# Altium schematic sheet power.SchDoc
size A4; SheetNumber: 3; SheetTotal: 6
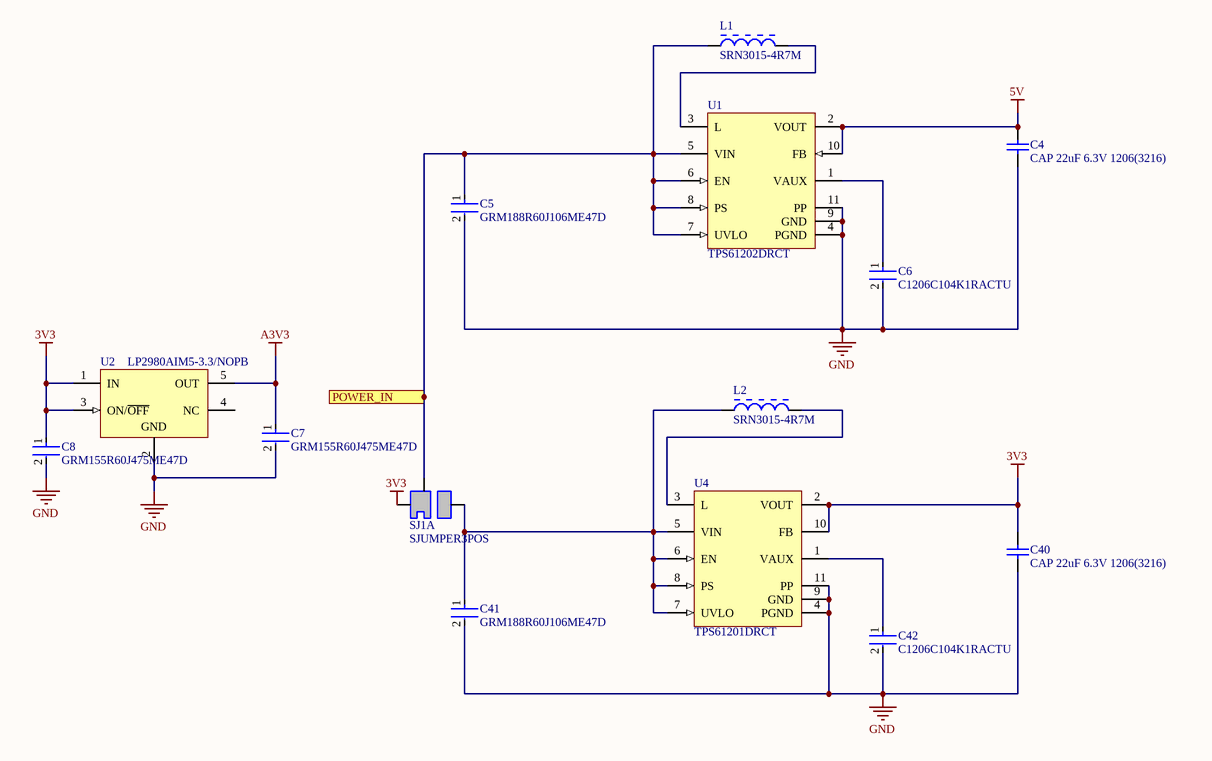
[diagram p0: power.SchDoc]

## Parts
C4  CAP 22uF 6.3V 1206(3216)  [CAPC1206(3216)190_M]
C5  GRM188R60J106ME47D  [FP-GRM188-0_1-e0_2_0_55-MFG]
C6  C1206C104K1RACTU  [FP-C1206C-EB-MFG]
C7  GRM155R60J475ME47D  [FP-GRM155-0_1-IPC_B]
C8  GRM155R60J475ME47D  [FP-GRM155-0_1-IPC_B]
C40  CAP 22uF 6.3V 1206(3216)  [CAPC1206(3216)190_M]
C41  GRM188R60J106ME47D  [FP-GRM188-0_1-e0_2_0_55-MFG]
C42  C1206C104K1RACTU  [FP-C1206C-EB-MFG]
L1  SRN3015-4R7M  [BOUR-SRN3015-2_V]
L2  SRN3015-4R7M  [BOUR-SRN3015-2_V]
SJ1  SJUMPER3POS  [SJUMPER3POS-Footprint-1]  (part A of 2)
U1  TPS61202DRCT  [DRC0010J_V]
U2  LP2980AIM5-3.3/NOPB  [MF05A_L]
U4  TPS61201DRCT  [DRC0010J_V]

## Ports
POWER_IN

## Nets
3V3: C8.1 C40.2 SJ1.1 U2.1(IN) U2.3(ON/~{OFF}) U4.2(VOUT) U4.10(FB)
5V: C4.2 U1.2(VOUT) U1.10(FB)
A3V3: C7.1 U2.5(OUT)
GND: C4.1 C5.2 C6.2 C7.2 C8.2 C40.1 C41.2 C42.2 U1.4(PGND) U1.9(GND) U1.11(PP) U2.2(GND) U4.4(PGND) U4.9(GND) U4.11(PP)
POWER_IN: C5.1 L1.1 SJ1.2 U1.5(VIN) U1.6(EN) U1.7(UVLO) U1.8(PS) ; port POWER_IN
NetC6_1: C6.1 U1.1(VAUX)
NetC41_1: C41.1 L2.1 SJ1.3 U4.5(VIN) U4.6(EN) U4.7(UVLO) U4.8(PS)
NetC42_1: C42.1 U4.1(VAUX)
NetL1_2: L1.2 U1.3(L)
NetL2_2: L2.2 U4.3(L)

Not connected (* = marked no-connect by the designer): U2 4(NC)

## Library data of the parts
C4 C40 = CMP-1037-04986-1: CAP 22uF 6.3V ±20% 1206 (3216 Metric) Thickness 1.9mm SMD; Case-EIA: 1206; Tolerance: Â±20%; Case-Metric: 3216; Value: 22uF; Max Thickness: 1.9 mm; Rated Voltage: 6.3 V; Technology: SMT
C5 C41 = CMP-2006-02792-2: Chip Multilayer Ceramic Capacitors for General Purpose, 0603, 10uF, X5R, 15%, 20%, 6.3V; Packaging: Tape and Reel; Voltage Rating (DC): 6.3V; Width: 0.031inch; Termination: SMD/SMT; Dielectric: X5R; Package Quantity: 4000; Voltage Rating: 6.3V; Capacitance: 10uF; Case/Package: 0603; Min Operating Temperature: -55°C; Voltage: 6.3V; Length: 1.6mm; Thickness: 0.035inch; Lead Free: Lead Free; Depth: 0.8mm; Case Code (Imperial): 0603; Max Operating Temperature: 85°C; Material: Ceramic; Height: 0.8mm; Tolerance: 20%; Mount: Surface Mount; REACH SVHC: No SVHC; Radiation Hardening: No; Case Code (Metric): 1608
C6 C42 = CMP-03020-000153-1: CAP CER 0.1UF 100V X7R 1206; Manufacturer: KEMET; Value: 0.10 μF; Tolerance: 0.1; Material: Ceramic; Temperature Coefficient: 15%; Automotive Grade: Grade 0; Voltage Rating: 100 V; Automotive: Yes; Ipc Land Pattern Name: CAPC320160X78; Device Class L1: Passive Components; ComponentLink2Description: Datasheet; Temperature Range Low: -55°C; Category: Cap; Octopart: https://octopart.com/c1206c104k1ractu-kemet-89521; Height: 0.88mm; Lead Free: Yes; Digikey Description: CAP CER 0.1UF 100V X7R 1206; Mouser Description: CAP CER 0.1UF 100V X7R 1206; Device Class L3: Ceramic Capacitors; Device Class L2: Capacitors; ComponentLink2URL: https://content.kemet.com/datasheets/KEM_C1007_X8R_ULTRA_150C_SMD.pdf; Temperature Range High: +150°C; Temperature Characteristic: X7R; Manufacturer Part Number: C1206C104K1RACTU; RoHS: TRUE; Capacitance: 0.10 μF; Package: C1206C-EB; Temperature: -55°C to +150°C
C7 C8 = CMP-2008-04549-2: Chip Multilayer Ceramic Capacitors for General Purpose, 0402, 4.7uF, X5R, 15%, 20%, 6.3V; Height: 0.5mm; Weight: 0.000212oz; Length: 1mm; Case Code (Metric): 1005; Packaging: Tape and Reel; Termination: SMD/SMT; Dielectric: X5R; Depth: 0.5mm; Case Code (Imperial): 0402; Min Operating Temperature: -55°C; Case/Package: 0402; Voltage: 6.3V; Width: 0.02inch; Capacitance: 4.7uF; Lead Free: Lead Free; Thickness: 0.022inch; Contact Plating: Tin; REACH SVHC: No SVHC; Package Quantity: 10000; Tolerance: 20%; Voltage Rating (DC): 6.3V; Voltage Rating: 6.3V; Mount: Surface Mount; Max Operating Temperature: 85°C
L1 L2 = CMP-0007-00005-1: Semi-shielded Power Inductor, 4.7 uH, +/- 20%, 1.4 A, -40 to 125 degC, 3 x 3 x 1.5 mm SMD, RoHS and Halogen Free, Tape and Reel; Manufacturer: Bourns; SRF Min: 65 MHz; Inductance: 4.7 uH; Isat: 1.2 A; Resistance to Solder Heat: +260 degC for 10 sec.; Rated current: 1.4 A; Inductance tolerance: +/- 20%; DCR Max: 0.136 Ohm; RoHS: TRUE; ComponentLink2Description: Datasheet; PackageDescription: 2-Pin SMD, Body 3 x 3 mm, Height 1.5 mm; ComponentLink2URL: http://www.bourns.com/data/global/pdfs/SRN3015.pdf; ComponentLink1URL: http://www.bourns.com/; Packing: Tape and Reel; Mounting Technology: Surface Mount; ComponentLink3URL: http://www.bourns.com/data/global/pdfs/SRN3015.pdf; PackageReference: SRN3015; Operating Temperature: -40 to 125 degC; DatasheetVersion: Aug-11; ComponentLink1Description: Manufacturer URL; ComponentLink3Description: Package Specification; PartNumber: SRN3015-4R7M
SJ1 = CMP-001-0001-1: 3 pins solder jumper
U1 = CMP-0347-00032-2: Boost Voltage Converter with 0.3 to 5.5 V Input and 5 V Output, -40 to 85 degC, 10-Pin SON (DRC), Green (RoHS & no Sb/Br); Manufacturer: Texas Instruments; Vin(Min)(V): 0.3; Vin(Max)(V): 5.5; Switching Frequency(Max)(kHz): 1250; SubFamily: Step-Up Regulator; Preset Vout(V): 5; Synchronous Rectification: TRUE; Regulated Outputs(#): 1; PackageVersion: revL, Sep-2011; Topology: Boost; PackageDescription: 10-Pin Plastic Small Outline No-Lead, 3 x 3 x 1 mm Body, 0.5 mm Pitch, Exposed Pad; PackageReference: DRC0010J; ComponentLink2Description: Package Specification; ComponentLink1URL: http://www.ti.com/general/docs/lit/getliterature.tsp?genericPartNumber=TPS61202&fileType=pdf; Eco-Plan: Green (RoHS & no Sb/Br); Mounting Technology: Surface Mount; DatasheetVersion: SLVS577B; PartNumber: TPS61202DRCT; Vout(Max)(V): 5; ComponentLink1Description: Datasheet; ComponentLink2URL: http://www.ti.com/litv/pdf/mpds117k; Vout(Min)(V): 5
U2 = CMP-0062-02170-2: Micropower 50 mA Ultra Low-Dropout Regulator, 5-pin SOT-23, Pb-Free; Manufacturer: National Semiconductor; PowerWise: N; CompType: LDO IC; PackageTopMarking: L00A*XTT; PackageReference: MF05A; DatasheetVersion: Sep-2006; PinCount: 5; ComponentLink3Description: MF05A Package Page; ComponentLink1URL: http://www.national.com/ds/LP/LP2980.pdf; PackageDescription: Molded SOT-23, .115 x .063 x .040 in Body, 5 Lead, .0375 in Pitch; RoHS: Y; RevisionNote: Component URLs added; ComponentLink3URL: http://www.national.com/packaging/folders/mf05a.html; PackageVersion: revD, Aug-2008; ComponentLink1Description: LP2980 Datasheet; ComponentLink2Description: LP2980 Web Page; ComponentLink2URL: http://www.national.com/pf/LP/LP2980.html
U4 = CMP-0343-00033-2: Boost Voltage Converter with 0.3 to 5.5 V Input and 3.3 V Output, -40 to 85 degC, 10-Pin SON (DRC), Green (RoHS & no Sb/Br); Manufacturer: Texas Instruments; Switching Frequency(Max)(kHz): 1250; Vin(Min)(V): 0.3; Preset Vout(V): 3.3; Vin(Max)(V): 5.5; Regulated Outputs(#): 1; Synchronous Rectification: TRUE; SubFamily: Step-Up Regulator; ComponentLink2Description: Package Specification; PackageVersion: revL, Sep-2011; DatasheetVersion: SLVS577B; PackageReference: DRC0010J; PackageDescription: 10-Pin Plastic Small Outline No-Lead, 3 x 3 x 1 mm Body, 0.5 mm Pitch, Exposed Pad; Vout(Min)(V): 3.3; ComponentLink1URL: http://www.ti.com/general/docs/lit/getliterature.tsp?genericPartNumber=TPS61201&fileType=pdf; ComponentLink1Description: Datasheet; Topology: Boost; Mounting Technology: Surface Mount; ComponentLink2URL: http://www.ti.com/litv/pdf/mpds117k; PartNumber: TPS61201DRCT; Eco-Plan: Green (RoHS & no Sb/Br); Vout(Max)(V): 3.3